# EAGLE design CS 16f1827 (EAGLE 6.6.0)
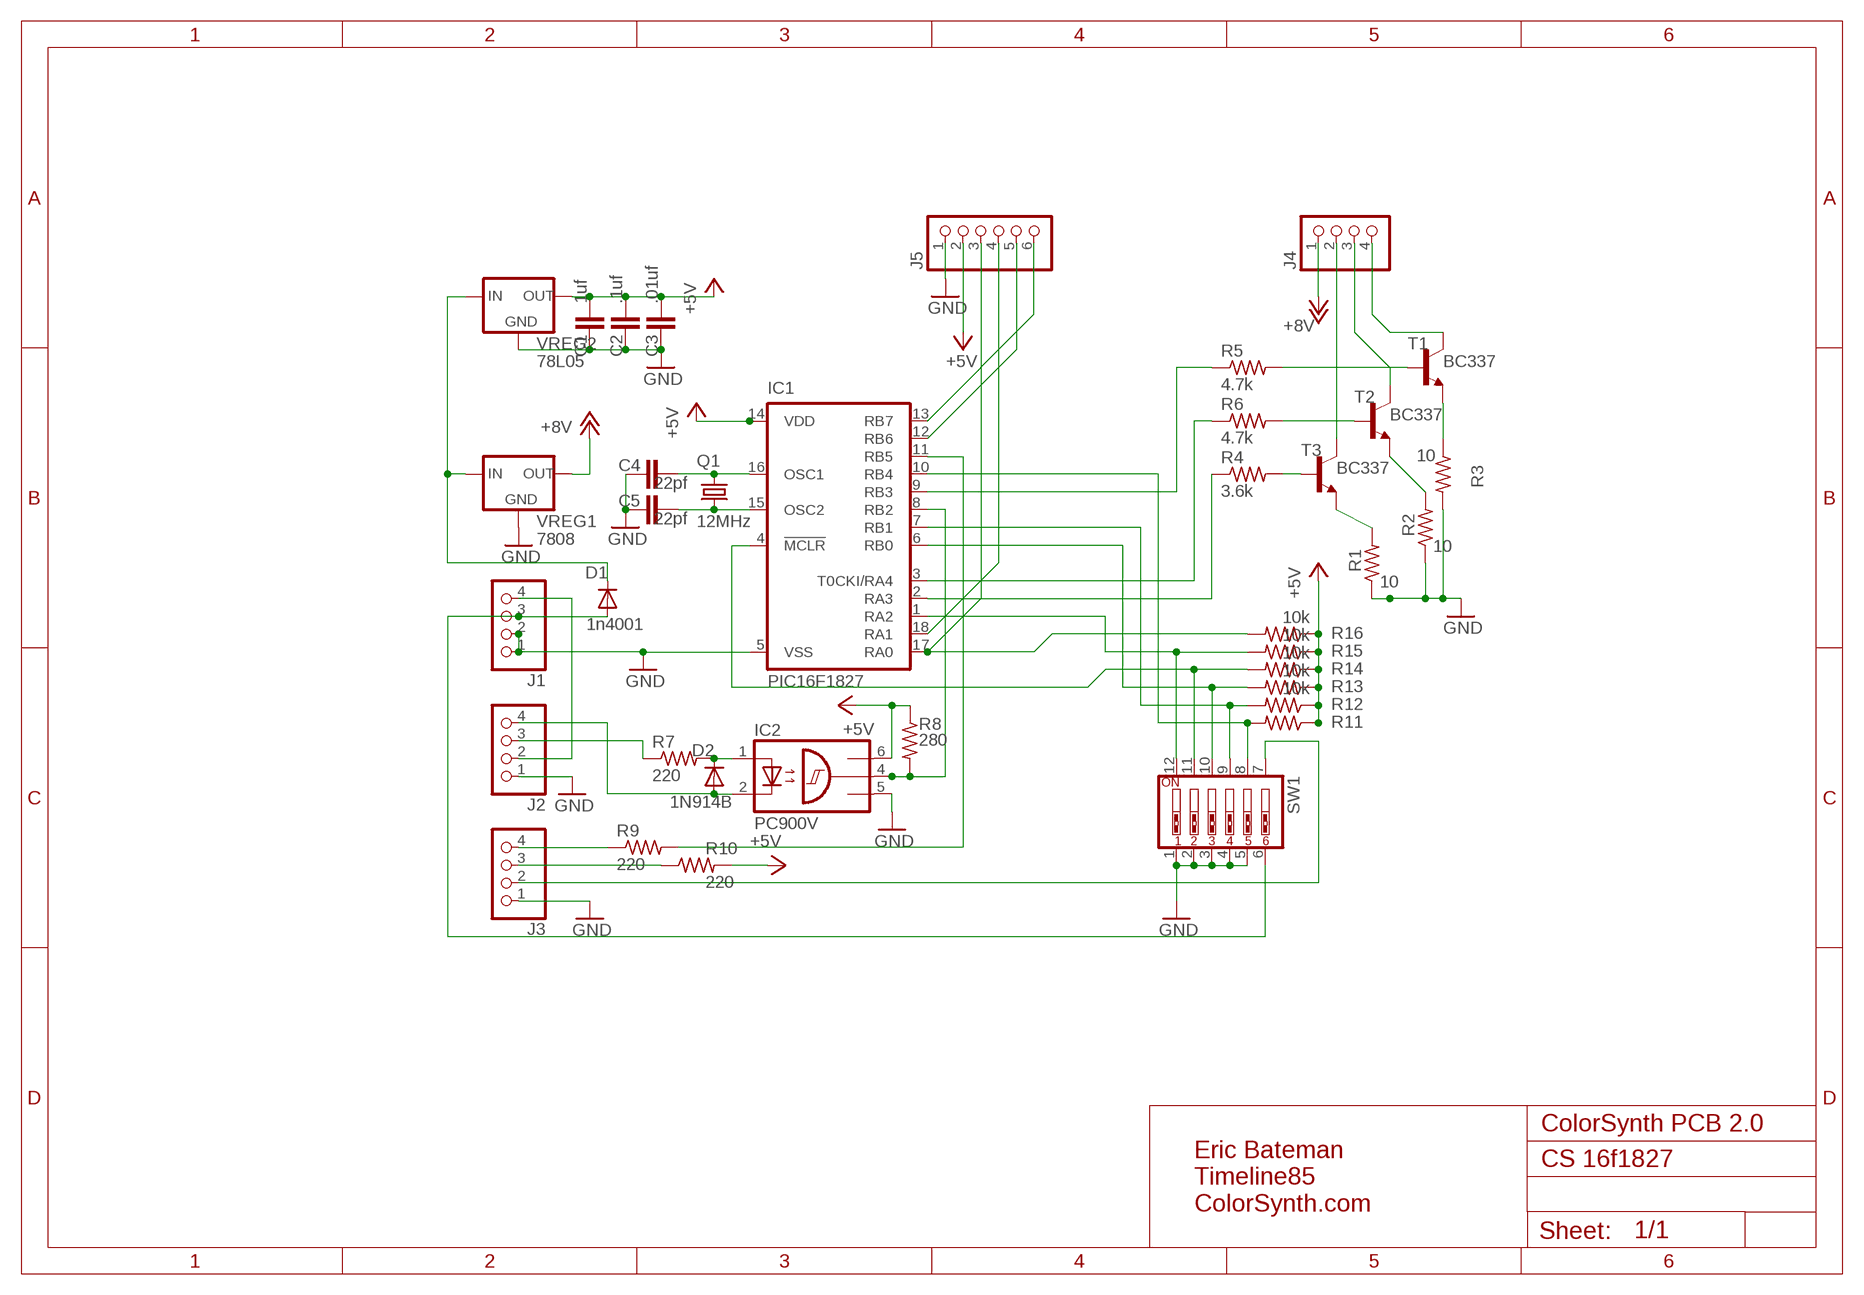
[diagram p0: schematic, sheet 1]

## Parts
C1  1uf  C5/3.5  [C5B3.5]
C2  .1uf  C5/3.5  [C5B3.5]
C3  .01uf  C5/3.5  [C5B3.5]
C4  22pf  C5/3.5  [C5B3.5]
C5  22pf  C5/3.5  [C5B3.5]
D1  1n4001  1N4148DO35-10  [DO35-10]
D2  1N914B  BAS15  [DO34-7]
IC1  PIC16F1827  PIC16F83P  [DIL18]
IC2  PC900V  OPI8013  [DIL06]
J1  PINHD-1X4  [1X04]
J2  PINHD-1X4  [1X04]
J3  PINHD-1X4  [1X04]
J4  PINHD-1X4  [1X04]
J5  PINHD-1X6  [1X06]
Q1  12MHz  CRYSTALHC49S  [HC49/S]
R1  10  R-US_0617/5V  [0617V]
R2  10  R-US_0617/5V  [0617V]
R3  10  R-US_0617/5V  [0617V]
R4  3.6k  R-US_0207/10  [0207/10]
R5  4.7k  R-US_0207/10  [0207/10]
R6  4.7k  R-US_0207/10  [0207/10]
R7  220  R-US_0207/10  [0207/10]
R8  280  R-US_0207/10  [0207/10]
R9  220  R-US_0207/10  [0207/10]
R10  220  R-US_0207/10  [0207/10]
R11  10k  R-US_0207/10  [0207/10]
R12  10k  R-US_0207/10  [0207/10]
R13  10k  R-US_0207/10  [0207/10]
R14  10k  R-US_0207/10  [0207/10]
R15  10k  R-US_0207/10  [0207/10]
R16  10k  R-US_0207/10  [0207/10]
SW1  SW_DIP-6  [EDG-06]
T1  BC337  [TO92-CBE]
T2  BC337  [TO92-CBE]
T3  BC337  [TO92-CBE]
VREG1  7808  78XXS  [78XXS]
VREG2  78L05  78LXX  [78LXX]

## Nets
5V: C1.1 C2.1 C3.1 IC1.14(VDD) IC2.6(VCC) J5.2 R8.1 R10.2 R11.1 R12.1 R13.1 R14.1 R15.1 R16.1 VREG2.OUT ; supply symbol labelled +5V
GND: C1.2 C2.2 C3.2 C4.2 C5.2 IC1.5(VSS) IC2.5(GND) J1.1 J1.2 J2.1 J3.1 J5.1 R1.1 R2.1 R3.2 SW1.1 SW1.2 SW1.3 SW1.4 SW1.5 VREG1.GND VREG2.GND
N$1: D2.A IC2.2(C) J2.4
N$2: D2.C IC2.1(A) R7.2
N$3: R5.2 T1.B
N$4: IC1.10(RB4) R11.2 SW1.8
N$5: R1.2 T3.E
N$6: C4.1 IC1.16(OSC1) Q1.1
N$7: C5.1 IC1.15(OSC2) Q1.2
N$8: IC1.2(RA3) R4.1
N$9: IC1.12(RB6) J5.5
N$10: IC1.3(T0CKI/RA4) R6.1
N$11: IC1.9(RB3) R5.1
N$12: R6.2 T2.B
N$13: R4.2 T3.B
N$14: J4.2 T3.C
N$15: IC1.7(RB1) R12.2 SW1.9
N$16: R2.2 T2.E
N$17: IC1.6(RB0) R13.2 SW1.10
N$18: IC1.4(!MCLR) R14.2 SW1.11
N$19: IC1.1(RA2) R15.2 SW1.12
N$20: IC1.18(RA1) J5.4
N$21: IC1.17(RA0) J5.3 R16.2
N$22: R3.1 T1.E
N$23: IC1.8(RB2) IC2.4(OUT) R8.2
N$24: D1.A J1.3 SW1.6
N$25: J4.1 VREG1.OUT ; supply symbol labelled +8V
N$27: IC1.11(RB5) R9.2
N$29: IC1.13(RB7) J5.6
N$30: J3.4 R9.1
N$31: J3.3 R10.1
N$32: J2.3 R7.1
N$34: J1.4 J2.2
N$37: J3.2 SW1.7
N$39: J4.3 T2.C
N$40: D1.C VREG1.IN VREG2.IN
N$41: J4.4 T1.C

## Notes on the sheet
- ColorSynth PCB 2.0
- Eric Bateman
  Timeline85
  ColorSynth.com

## Library data of the parts
C1-C5 = capacitor-wima:C: CAPACITOR naming: grid - package width
D1 = diode:1N4148: DIODE high speed (Philips)
D2 = diode:BAS15: DIODE high speed
IC1 = microchip:PIC16F8*: MICROCONTROLLER 8-Bit PIC16F8X Family - CMOS Flash/EEPROM Pin Compatible : PIC16F83, PIC16CR83, PIC16F84A, PIC16CR84 see also PIC16C*
IC2 = optocoupler:OPI8013: OPTO COUPLER
J1-J4 = pinhead:PINHD-1X4: PIN HEADER
J5 = pinhead:PINHD-1X6: PIN HEADER
Q1 = crystal:CRYSTAL: CRYSTAL
R1-R16 = resistor:R-US_: RESISTOR, American symbol
SW1 = special:SW_DIP-6: DIP SWITCH
T1-T3 = transistor-neu-to92:BC337: NPN TRANSISTOR
VREG1 = v-reg:78XXS: VOLTAGE REGULATOR
VREG2 = v-reg2:78LXX: VOLTAGE REGULATOR

## Board
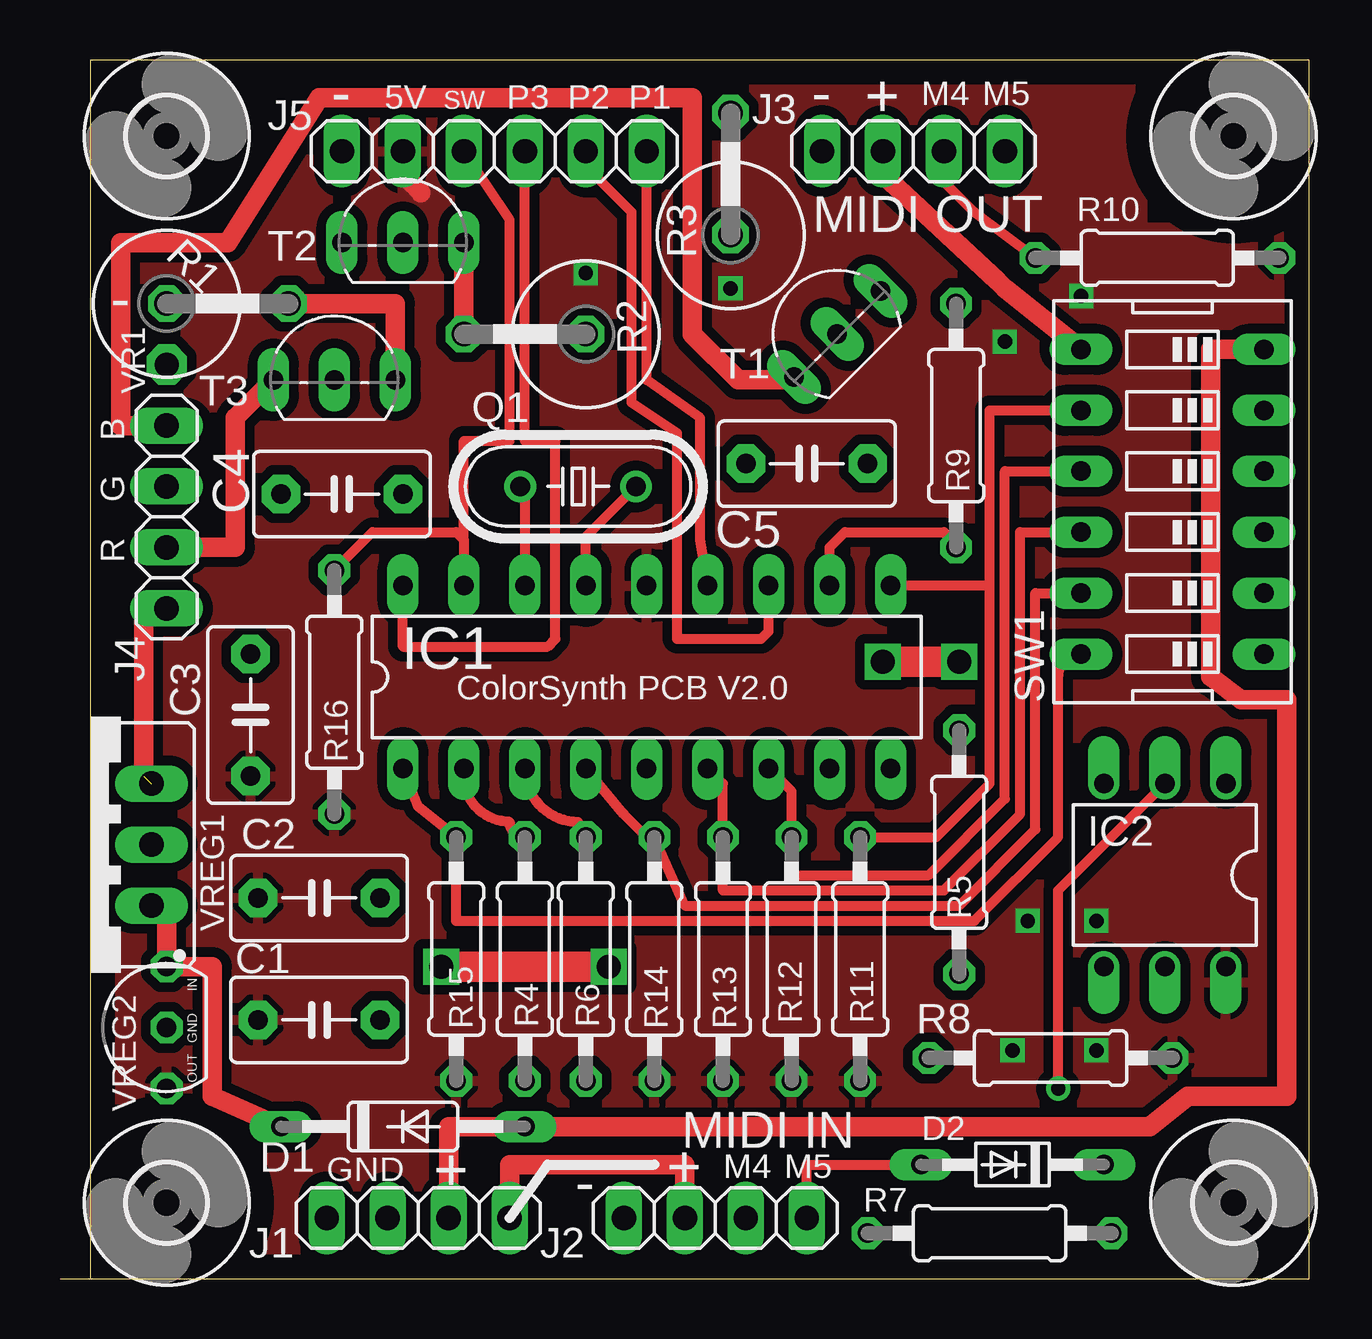
[diagram p1: board, top side]
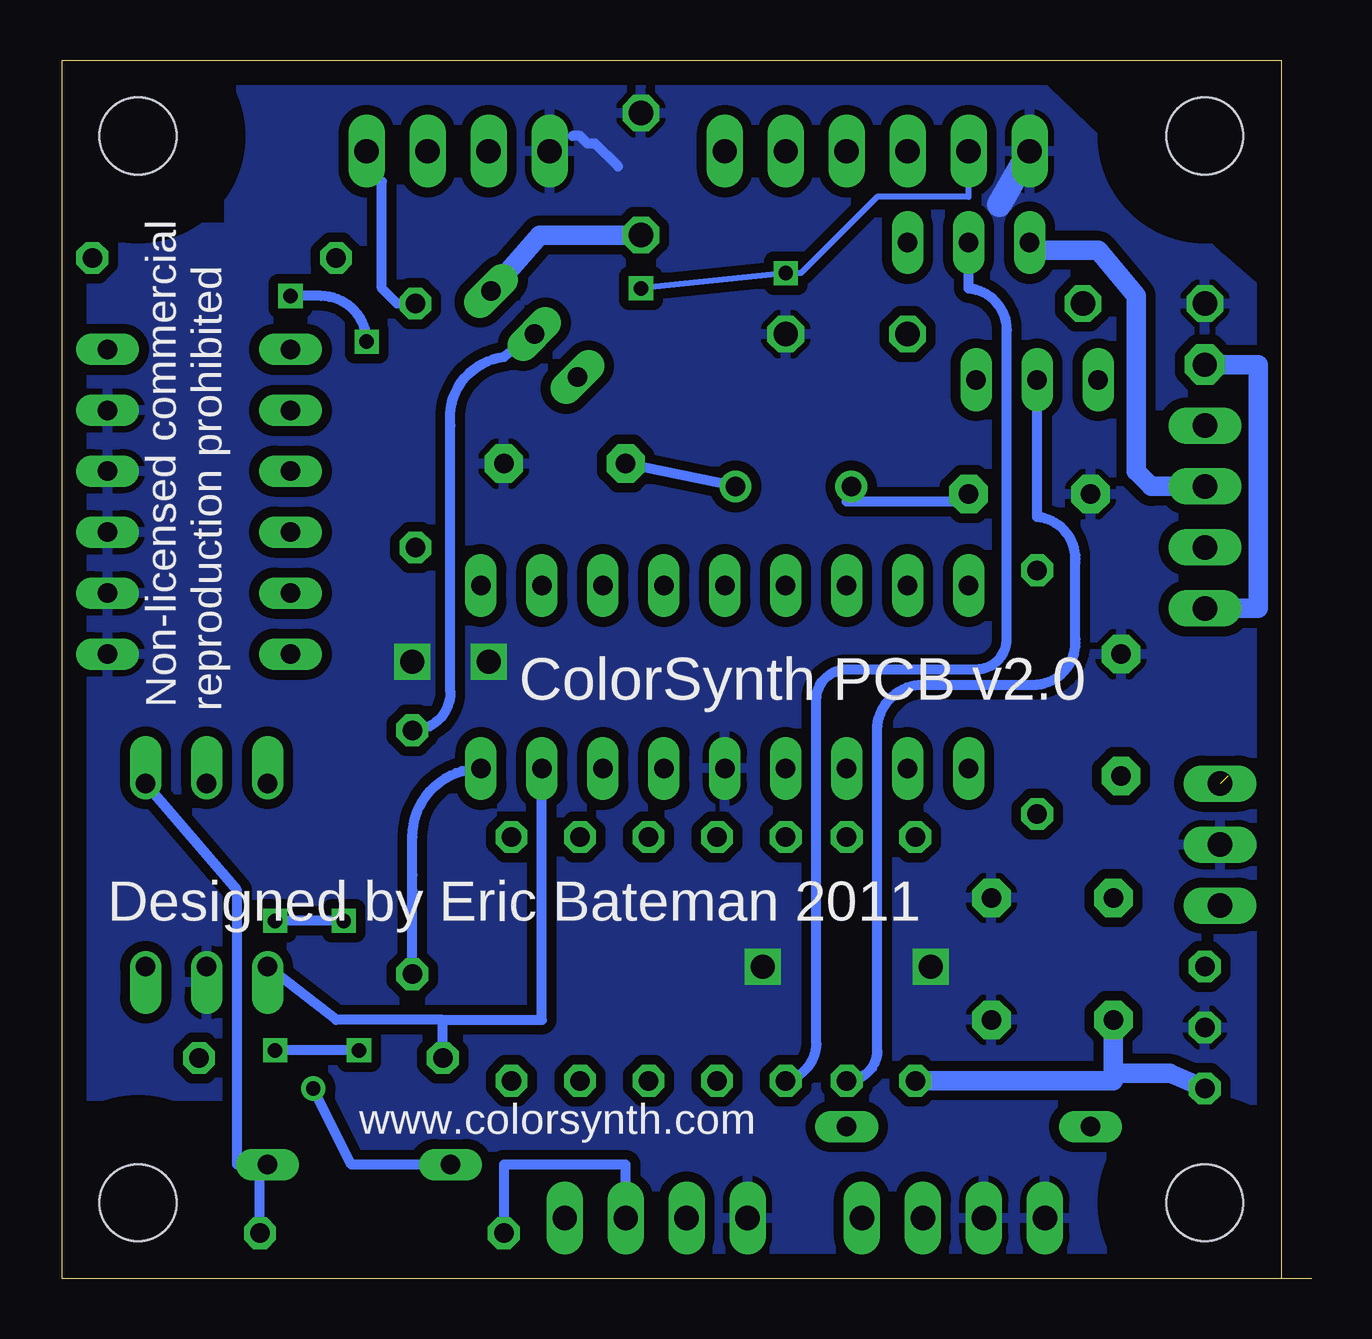
[diagram p2: board, bottom side, seen from below]

Size 52.06 x 50.79 mm. Coordinates in mm from the lower left corner, seen from the top.
Outline: 1.27,0 52.06,0 52.06,50.79 1.27,50.79 1.27,0
Outline: 0,0 1.27,0
Copper layers (1*16): Top 0.035mm / dielectric 1.5mm / Bottom 0.035mm
Design rules "default": minimum track width 10mil, minimum drill 24mil, track to track 8mil, track to pad 8mil, pad to pad 8mil, via to via 8mil, smd to smd 8mil, copper to edge 40mil, drill to drill 8mil, minimum pad ring 10mil, minimum via ring 8mil, stop-mask expansion 4mil, vias tented up to drill 0mil, thermal gap 10mil

### Footprints (pad centres in the part's own frame; a part is rotated, then mirrored left to right if it is on the bottom)
C5B3.5 = drill 0.813 pad 1.6 octagon: 1 -2.54,0; 2 2.54,0
DO35-10 = drill 0.813 long: A 5.08,0; C -5.08,0
DO34-7 = drill 0.813 long: A 3.81,0; C -3.81,0
DIL18 = drill 0.813 long: 1 -10.16,-3.81; 2 -7.62,-3.81; 3 -5.08,-3.81; 4 -2.54,-3.81; 5 0,-3.81; 6 2.54,-3.81; 7 5.08,-3.81; 8 7.62,-3.81; 9 10.16,-3.81; 10 10.16,3.81; 11 7.62,3.81; 12 5.08,3.81; 13 2.54,3.81; 14 0,3.81; 15 -2.54,3.81; 16 -5.08,3.81; 17 -7.62,3.81; 18 -10.16,3.81
DIL06 = drill 0.813 offset: 1 -2.54,-3.81; 2 0,-3.81; 3 2.54,-3.81; 4 2.54,3.81; 5 0,3.81; 6 -2.54,3.81
1X04 = drill 1.016 long: 1 -3.81,0; 2 -1.27,0; 3 1.27,0; 4 3.81,0
1X06 = drill 1.016 long: 1 -6.35,0; 2 -3.81,0; 3 -1.27,0; 4 1.27,0; 5 3.81,0; 6 6.35,0
HC49/S = drill 0.813: 1 -2.413,0; 2 2.413,0
0617V = drill 1.016 octagon: 1 -2.54,0; 2 2.54,0
0207/10 = drill 0.813 octagon: 1 -5.08,0; 2 5.08,0
EDG-06 = drill 0.813 long: 1 -6.35,-3.81; 2 -3.81,-3.81; 3 -1.27,-3.81; 4 1.27,-3.81; 5 3.81,-3.81; 6 6.35,-3.81; 7 6.35,3.81; 8 3.81,3.81; 9 1.27,3.81; 10 -1.27,3.81; 11 -3.81,3.81; 12 -6.35,3.81
TO92-CBE = drill 0.813 long: B 0,0; C -2.54,0; E 2.54,0
3,2 = hole 3.2: 0,0
78XXS = drill 1.016 long: GND 0,-2.54; IN -2.54,-2.54; OUT 2.54,-2.54
78LXX = drill 0.813 octagon: GND 0,0; IN 2.54,0; OUT -2.54,0

### Placement (x,y rotation side)
C1  10.79,10.79 0 top
C2  10.79,15.88 0 top
C3  7.94,23.5 90 top
C4  11.75,32.7 180 top
C5  31.11,33.97 0 top
D1  14.29,6.35 0 top
D2  39.69,4.76 180 top
IC1  24.45,25.08 0 top
IC2  46.04,16.83 180 top
J1  14.92,2.54 0 top
J2  27.3,2.54 0 top
J3  35.56,46.99 0 top
J4  4.45,31.75 90 top
J5  18.1,46.99 0 top
Q1  21.59,33.02 0 top
R1  6.98,40.64 0 top
R2  19.37,39.37 180 top
R3  27.94,46.04 90 top
R4  19.37,13.34 270 top
R5  37.47,17.78 90 top
R6  21.91,13.34 270 top
R7  38.74,1.91 0 top
R8  41.28,9.21 180 top
R9  37.34,35.56 270 top
R10  45.72,42.55 0 top
R11  33.34,13.34 90 top
R12  30.48,13.34 90 top
R13  27.62,13.34 90 top
R14  24.77,13.34 90 top
R15  16.51,13.34 90 top
R16  11.43,24.45 90 top
SW1  46.36,32.38 90 top
T1  32.38,39.37 45 top
T2  14.29,43.18 0 top
T3  11.43,37.47 0 top
U$1  [3,2]  48.9,3.17 0 top
U$2  [3,2]  48.9,47.62 0 top
U$3  [3,2]  4.45,47.62 0 top
U$4  [3,2]  4.45,3.17 0 top
VREG1  1.27,18.1 90 top
VREG2  4.45,10.48 90 top

### Tracks (layer width: path | path; a pad name or v marks a point on that pad's centre or on a via)
5V  (via drill 0.6)
  Top 0.813: J5.2 14.29,46.04 14.92,45.4 15.03,45.26
  Bottom 0.254: J5.2 14.29,45.09 18.1,45.09 21.27,41.91 v21.91,41.91 v27.94,41.27
  Bottom 0.406: v39.69,9.53 v43.18,9.53 | v40.32,14.92 v43.18,14.92 | v39.37,39.05 arc-90 41.28,40.96 v42.55,40.96
  Bottom 0.813: VREG2.OUT 5.9,8.57 8.26,8.57 | 8.26,8.57 C1.1 | R15.1 8.26,8.26 8.26,8.57
  pour Top (isolate 0.406): 1.59,40.64 11.75,50.16 45.09,50.16 45.09,43.81 51.75,43.81 51.75,6.99 45.72,6.99 45.72,5.71 27.3,5.71 27.3,0.32 8.26,0.32 8.26,6.99 1.59,6.99
GND  (via drill 1)
  Top 1.27: v34.29,25.72 v37.47,25.72 | v15.88,13.02 v22.86,13.02
  Bottom 0.406: 30.8,47.62 30.48,47.62 30.16,47.31 29.84,47.31 28.89,46.35
  Bottom 1.016: 13.02,44.77 J5.1
  pour Bottom (isolate 0.406): 1.59,40.64 1.59,6.99 8.26,6.99 8.26,0.32 43.5,0.32 43.5,7.62 51.75,7.62 51.75,43.81 45.09,43.81 45.09,50.48 12.06,50.48 3.81,42.55
N$1  (via drill 0.6)
  Top 0.406: D2.A 31.11,4.76 J2.4 | IC2.2 41.59,16.19 v41.59,7.94
  Bottom 0.406: v41.59,7.94 40.01,4.76 D2.A
N$2
  Bottom 0.406: IC2.1 44.77,16.19 44.77,4.76 43.82,4.76 | R7.2 43.82,4.76 | 43.82,4.76 D2.C
N$3
  Bottom 0.406: 33.66,38.42 arc-90 35.88,35.56 35.88,24.45 arc90 R5.2 | 33.66,38.42 | 33.66,38.42 T1.B
N$4
  Top 0.406: SW1.8 38.74,36.2 38.74,28.89 | 38.74,28.89 38.74,20.64 36.51,18.41 R11.2 | 38.74,28.89 IC1.10
N$5
  Top 0.813: R1.2 9.84,40.85 9.84,40.64 13.97,40.64 T3.E
N$6
  Top 0.406: IC1.16 19.37,32.83 Q1.1
  Bottom 0.406: C4.1 14.61,32.38 19.37,32.38 19.18,32.58 Q1.1
N$7
  Top 0.406: IC1.15 21.91,30.92 Q1.2
  Bottom 0.406: Q1.2 C5.1
N$8
  Top 0.406: 19.37,18.73 R4.1 arc-90 18.73,19.05 arc-90 16.83,20.95 IC1.2
N$9
  Top 0.406: J5.5 21.91,46.35 23.81,44.45 23.81,36.51 25.72,35.24 25.72,26.67 29.21,26.67 29.53,26.99 IC1.12
N$10
  Top 0.406: 21.91,18.73 R6.1 arc-90 21.59,18.73 21.59,19.05 arc-90 IC1.3
N$11
  Bottom 0.406: R5.1 37.47,16.19 37.47,16.83 37.47,18.41 arc90 IC1.9
N$12
  Bottom 0.406: R6.2 arc-77 20.64,9.84 20.64,24.13 arc90 19.37,25.4 13.97,25.4 arc-90 12.7,26.67 12.7,39.37 arc-90 14.29,41.27 T2.B
N$13
  Bottom 0.406: R4.2 arc-90 18.1,9.53 18.1,22.86 arc90 16.19,24.77 11.43,24.77 arc-90 9.84,26.67 9.84,29.84 arc-90 11.43,31.75 T3.B
N$14
  Top 0.813: T3.C 7.3,35.88 7.3,30.48 J4.2
N$15
  Top 0.406: SW1.9 39.37,33.66 39.37,20 36.2,16.83 30.48,16.83 R12.2 30.48,20.32 IC1.7
N$16
  Top 0.813: R2.2 T2.E
N$17
  Top 0.406: SW1.10 40.01,31.11 40.01,19.37 36.83,16.19 27.62,16.19 R13.2 27.62,20.64 IC1.6
N$18
  Top 0.406: SW1.11 40.64,28.57 40.64,18.73 37.47,15.56 26.04,15.56 R14.2 24.45,18.41 23.5,19.37 IC1.4
N$19
  Top 0.406: SW1.12 arc90 41.59,25.08 41.59,18.41 38.1,14.92 16.51,14.92 R15.2 14.92,19.68 IC1.1
N$20
  Top 0.406: J5.4 19.37,34.92 20.64,34.92 20.64,26.67 20.32,26.35 14.29,26.35 IC1.18
N$21
  Top 0.406: R16.2 13.02,31.11 16.51,31.11 16.83,30.8 | 16.83,30.8 IC1.17 | J5.3 18.73,44.13 18.73,34.92 16.83,34.92 16.83,30.8
N$22
  Bottom 0.813: R3.1 32.17,43.5 T1.E
N$23
  Bottom 0.406: IC1.8 32.07,10.79 36.2,10.79 | R8.2 36.2,10.79 | 36.2,10.79 40.64,10.79 IC2.4
N$24
  Top 0.813: SW1.6 47.94,38.73 47.94,25.08 49.21,24.13 51.12,24.13 51.12,7.62 46.99,7.62 45.4,6.35 D1.A 16.19,6.35 J1.3
N$25  (via drill 1 pad 1.68)  (1 unrouted)
  Top 0.813: 3.49,20.95 3.49,27.94 J4.1
  Bottom 0.813: v4.45,38.1 2.22,38.1 2.22,27.94 J4.1
N$27
  Top 0.406: R9.2 36.83,31.11 32.7,31.11 32.07,30.48 IC1.11
N$29
  Top 0.406: J5.6 24.45,37.47 26.67,35.88 26.67,30.8 IC1.13
N$30
  Bottom 0.406: R9.1 38.1,40.64 38.74,41.27 38.74,45.72 39.37,46.35 J3.4
N$31
  Top 0.406: J3.3 36.83,45.72 38.1,44.45 R10.1
N$32
  Bottom 0.406: J2.3 28.57,4.76 33.66,4.76 R7.1
N$34
  Top 0.813: J1.4 18.73,4.76 26.04,4.76 J2.2
N$37
  Top 0.813: J3.2 34.61,45.72 39.05,41.59 39.37,41.27 SW1.7
N$39
  Bottom 0.813: J4.3 6.67,33.02 7.3,33.66 7.3,40.96 8.89,42.86 11.43,42.86 T2.C
N$40
  Top 0.813: D1.C 6.35,7.62 6.35,13.02 VREG2.IN 4.45,15.56 VREG1.IN
N$41
  Top 0.813: J4.4 2.54,35.56 2.54,43.18 6.98,43.18 10.79,49.21 26.35,49.21 26.35,39.37 28.26,37.47 30.8,37.47 T1.C

### Text on the board
tNames: - | 5V | SW | P3 | P2 | P1 | - | M4 | M5 | + | MIDI OUT | - | VR1 | B | G | R | ColorSynth PCB V2.0 | MIDI IN | GND | + | + | M4 | M5 | -
bNames: Non-licensed commercial | reproduction prohibited | ColorSynth PCB v2.0 | Designed by Eric Bateman 2011 | www.colorsynth.com